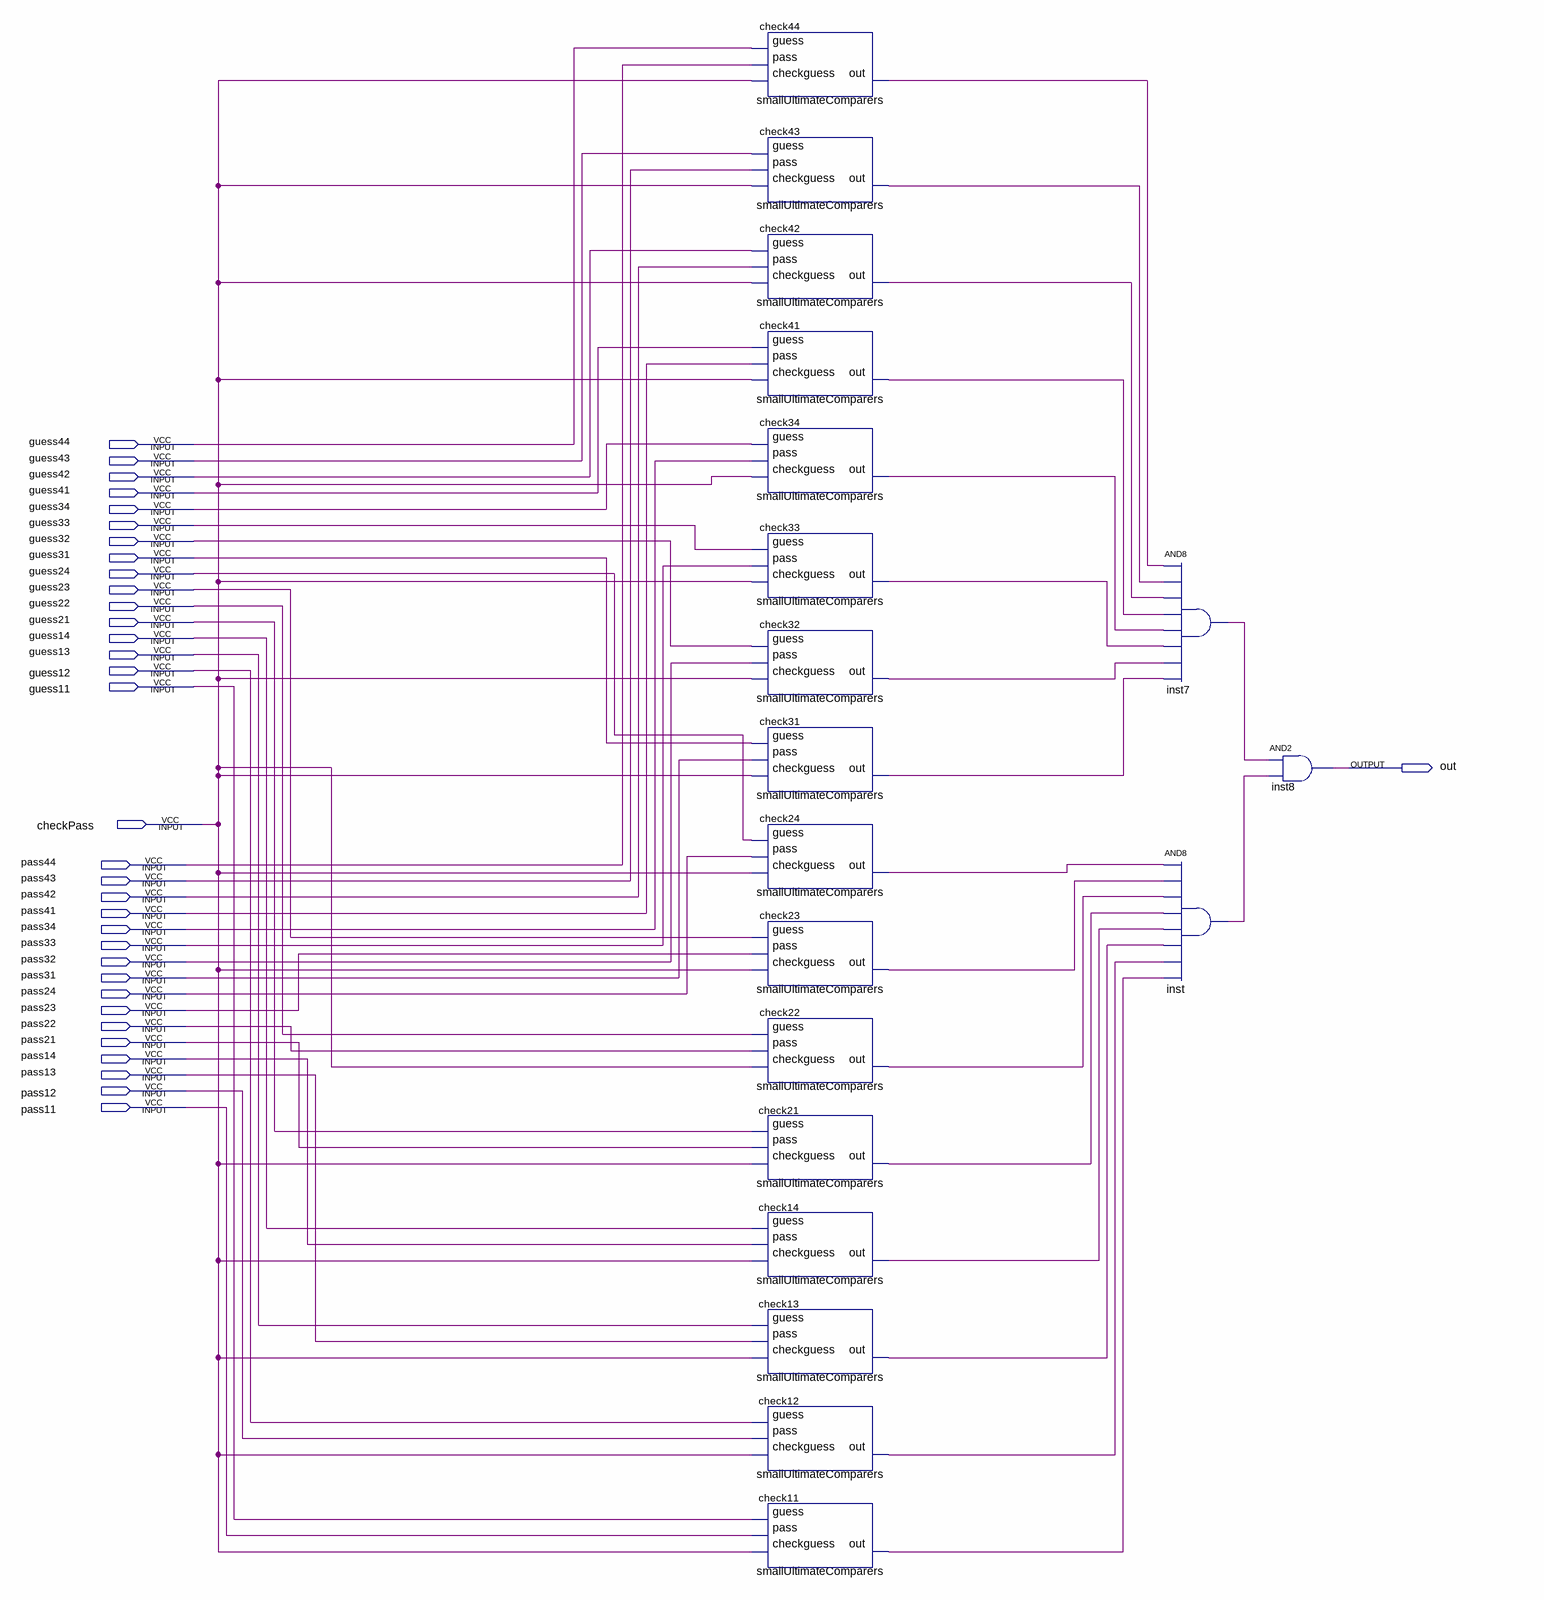
[diagram p0: schematic sheet]
// Quartus schematic theUltimateComparer.bdf as structural Verilog: 19 symbols, 34 pins
module theUltimateComparer (
  input  guess44,
  input  guess43,
  input  guess42,
  input  guess41,
  input  guess34,
  input  guess33,
  input  guess32,
  input  guess31,
  input  guess24,
  input  guess23,
  input  guess22,
  input  guess21,
  input  guess14,
  input  guess13,
  input  guess12,
  input  guess11,
  input  checkPass,
  input  pass44,
  input  pass43,
  input  pass42,
  input  pass41,
  input  pass34,
  input  pass33,
  input  pass32,
  input  pass31,
  input  pass24,
  input  pass23,
  input  pass22,
  input  pass21,
  input  pass14,
  input  pass13,
  input  pass12,
  input  pass11,
  output out
);

  wire check11_out, check12_out, check13_out, check14_out, check21_out, check22_out, check23_out,
       check24_out, check31_out, check32_out, check33_out, check34_out, check41_out, check42_out,
       check43_out, check44_out, inst7_out, inst_out;

  smallUltimateComparers check44 (.checkguess(checkPass), .pass(pass44), .guess(guess44), .out(check44_out));
  smallUltimateComparers check43 (.checkguess(checkPass), .pass(pass43), .guess(guess43), .out(check43_out));
  smallUltimateComparers check42 (.checkguess(checkPass), .pass(pass42), .guess(guess42), .out(check42_out));
  smallUltimateComparers check41 (.checkguess(checkPass), .pass(pass41), .guess(guess41), .out(check41_out));
  smallUltimateComparers check34 (.checkguess(checkPass), .pass(pass34), .guess(guess34), .out(check34_out));
  smallUltimateComparers check33 (.checkguess(checkPass), .pass(pass33), .guess(guess33), .out(check33_out));
  smallUltimateComparers check32 (.checkguess(checkPass), .pass(pass32), .guess(guess32), .out(check32_out));
  smallUltimateComparers check31 (.checkguess(checkPass), .pass(pass31), .guess(guess31), .out(check31_out));
  smallUltimateComparers check24 (.checkguess(checkPass), .pass(pass24), .guess(guess24), .out(check24_out));
  smallUltimateComparers check23 (.checkguess(checkPass), .pass(pass23), .guess(guess23), .out(check23_out));
  smallUltimateComparers check22 (.checkguess(checkPass), .pass(pass22), .guess(guess22), .out(check22_out));
  smallUltimateComparers check21 (.checkguess(checkPass), .pass(pass21), .guess(guess21), .out(check21_out));
  smallUltimateComparers check14 (.checkguess(checkPass), .pass(pass14), .guess(guess14), .out(check14_out));
  smallUltimateComparers check13 (.checkguess(checkPass), .pass(pass13), .guess(guess13), .out(check13_out));
  smallUltimateComparers check12 (.checkguess(checkPass), .pass(pass12), .guess(guess12), .out(check12_out));
  smallUltimateComparers check11 (.checkguess(checkPass), .pass(pass11), .guess(guess11), .out(check11_out));
  and inst7 (inst7_out, check44_out, check43_out, check42_out, check41_out, check34_out, check33_out, check32_out, check31_out);
  and inst (inst_out, check24_out, check23_out, check22_out, check21_out, check14_out, check13_out, check12_out, check11_out);
  and inst8 (out, inst7_out, inst_out);
endmodule
